# EAGLE design gbg_base_reva (EAGLE 9.1.3)
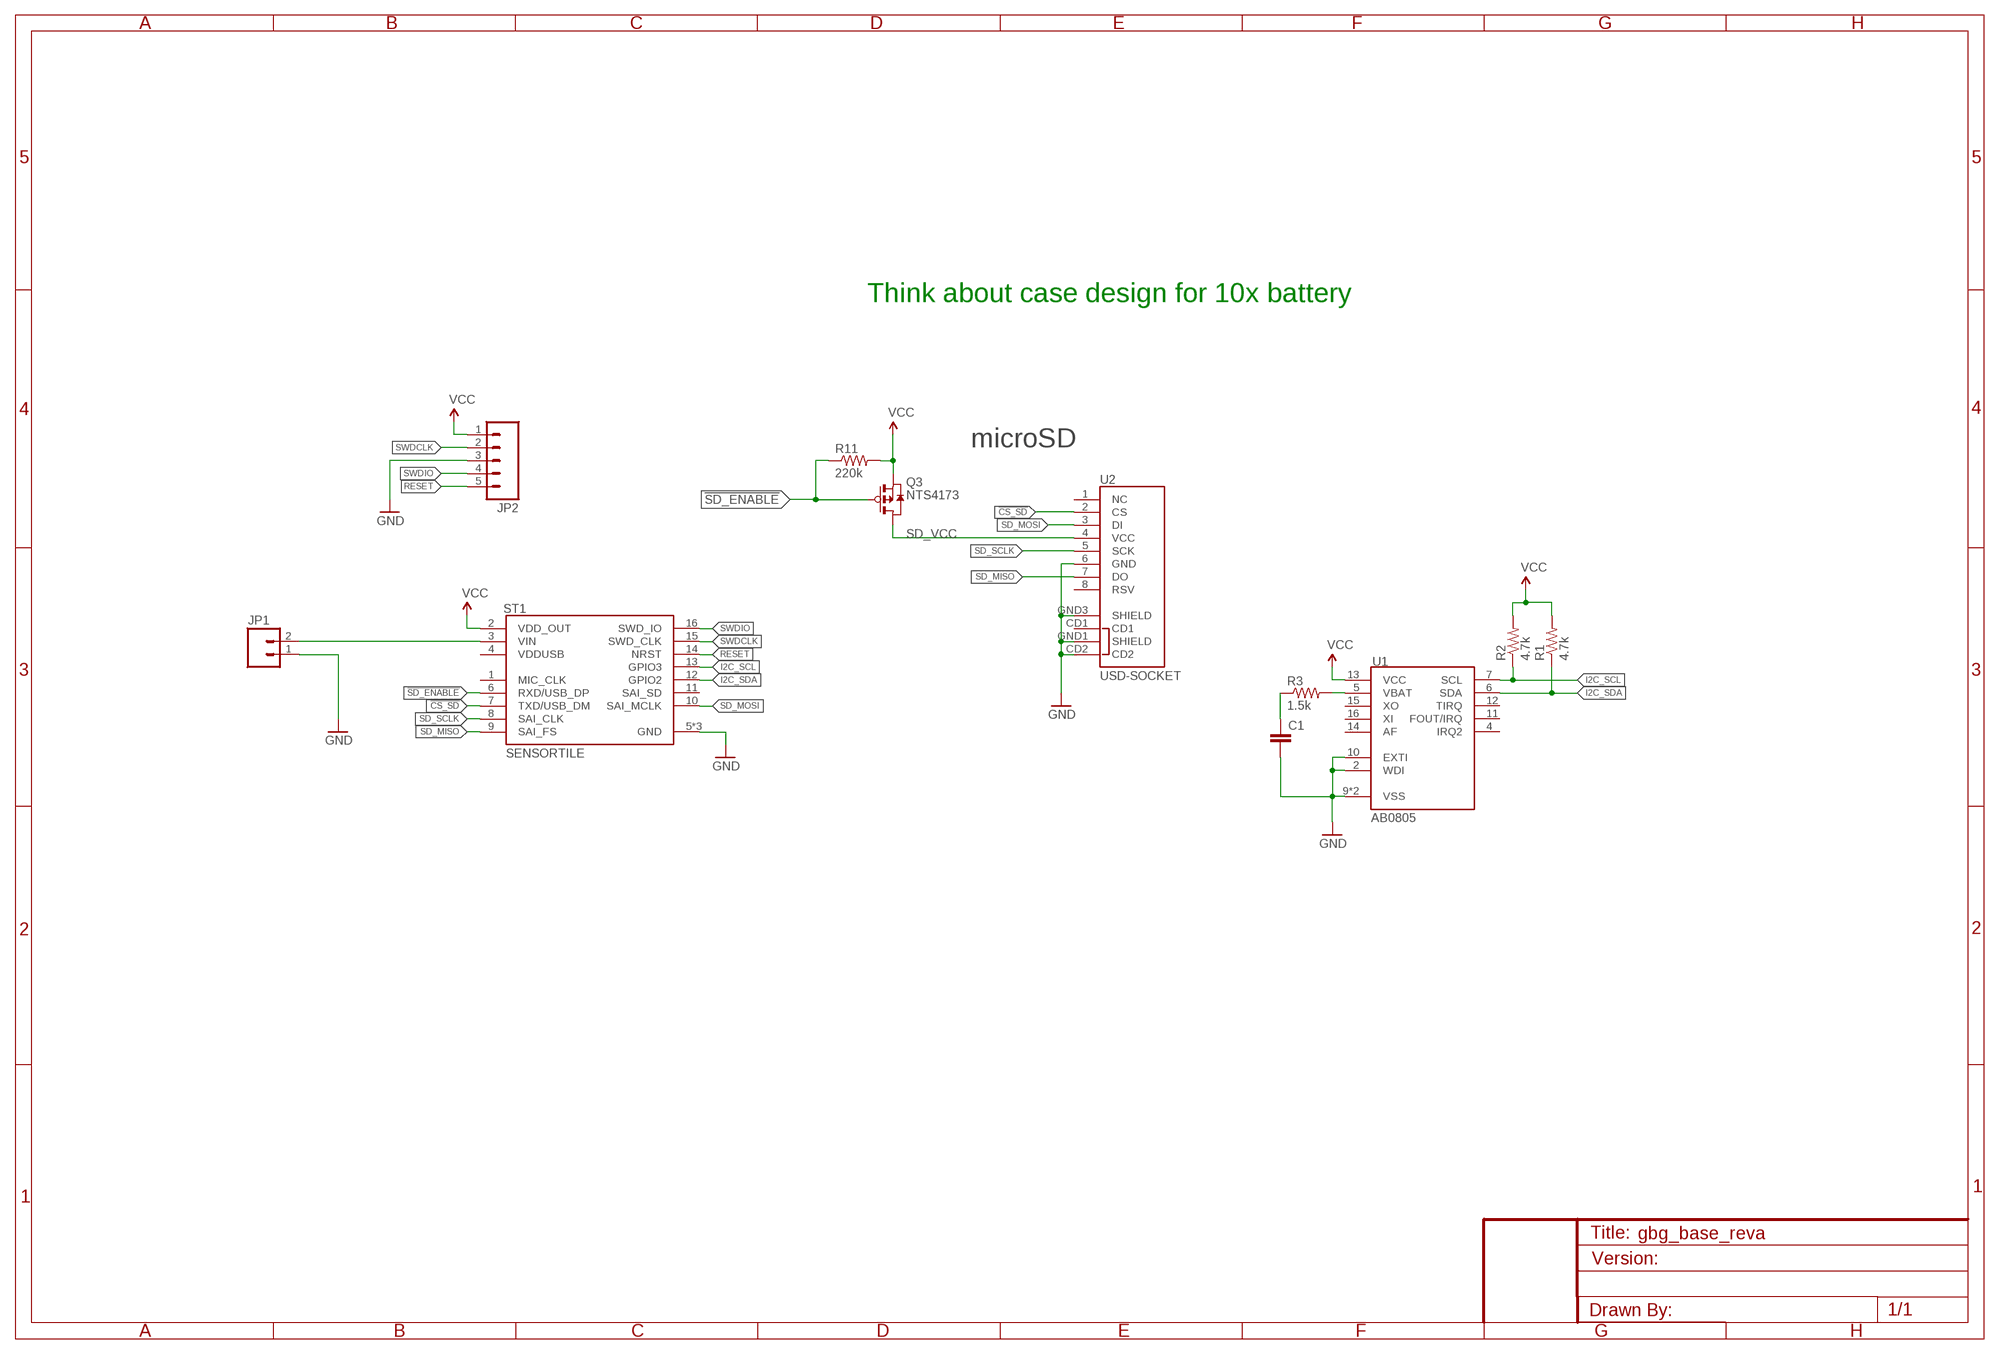
[diagram p0: schematic, sheet 1]

## Parts
C1  CAP1210  [1210]
JP1  M02PTH  [1X02]
JP2  M05LOCK  [1X05_LOCK]
Q3  NTS4173  [SC-70-3]
R1  4.7k  RESISTOR0603  [0603-RES]
R2  4.7k  RESISTOR0603  [0603-RES]
R3  1.5k  RESISTOR0603  [0603-RES]
R11  220k  R-EU0603  [0603]
ST1  SENSORTILE  [SENSORTILE]
U1  AB0805  [QFN16]
U2  USD-SOCKET  [MICROSD_1:1]

## Nets
!CS_SD: ST1.7(TXD/USB_DM) U2.2(CS)
!SD_ENABLE: Q3.P1(G) R11.1 ST1.6(RXD/USB_DP)
GND: C1.2 JP1.1 JP2.3 ST1.5(GND) ST1.17(GND) ST1.18(GND) U1.2(WDI) U1.9(VSS) U1.10(EXTI) U1.TH(VSS) U2.6(GND) U2.CD2 U2.GND1(SHIELD) U2.GND3(SHIELD)
I2C_SCL: R2.1 ST1.13(GPIO3) U1.7(SCL)
I2C_SDA: R1.1 ST1.12(GPIO2) U1.6(SDA)
N$1: C1.1 R3.1
N$5: R3.2 U1.5(VBAT)
RESET: JP2.5 ST1.14(NRST)
SD_MISO: ST1.9(SAI_FS) U2.7(DO)
SD_MOSI: ST1.10(SAI_MCLK) U2.3(DI)
SD_SCLK: ST1.8(SAI_CLK) U2.5(SCK)
SD_VCC: Q3.P3(D) U2.4(VCC)
SWDCLK: JP2.2 ST1.15(SWD_CLK)
SWDIO: JP2.4 ST1.16(SWD_IO)
VBAT: JP1.2 ST1.3(VIN)
VCC: JP2.1 Q3.P2(S) R1.2 R2.2 R11.2 ST1.2(VDD_OUT) U1.13(VCC)
Unconnected: ST1.1(MIC_CLK) ST1.4(VDDUSB) ST1.11(SAI_SD) U1.4(IRQ2) U1.11(FOUT/IRQ) U1.12(TIRQ) U1.14(AF) U1.15(XO) U1.16(XI) U2.1(NC) U2.8(RSV) U2.CD1

## Notes on the sheet
- Think about case design for 10x battery
- microSD

## Library data of the parts
C1 = SparkFun-Passives:CAP: Capacitor Standard 0603 ceramic capacitor, and 0.1" leaded capacitor.; DIGIKEY: 728-1067-2-ND
JP1 = SparkFun-Connectors:M02: Standard 2-pin 0.1" header. Use with - straight break away headers ( PRT-00116) - right angle break away headers (PRT-00553) - swiss pins (PRT-00743) - machine pins (PRT-00117) - female headers (PRT-00115) Molex polarized connector foot print use with: PRT-08233 with associated crimp pins and housings. 2.54_SCREWTERM for use with PRT-10571. 3.5mm Screw Terminal footprints for PRT-08084 5mm Screw Terminal footprints for use with PRT-08432
JP2 = SparkFun-Connectors:M05: Header 5 Standard 5-pin 0.1" header. Use with straight break away headers (SKU : PRT-00116), right angle break away headers (PRT-00553), swiss pins (PRT-00743), machine pins (PRT-00117), and female headers (PRT-00115). Molex polarized connector foot print use with SKU : PRT-08230 with associated crimp pins and housings.
Q3 = nts4173p:NTS4173: NTS4173P: Power MOSFET −30 V, −1.3 A, Single P−Channel, SC−70 Features • −30 V BVds, Low RDS(on) in SC−70 Package • Low Threshold Voltage • Fast Switching Speed • This is a Halide−Free Device • This is a Pb−Free Device Applications • Load Switch • Low Current Inverter and DC−DC Converters • Power Switch for Printers, Communication Equipment; DIGIKEY: NTS4173PT1GOSCT-ND
R1-R3 = SparkFun-Resistors:RESISTOR: Resistor Basic schematic elements and footprints for 0603, 1206, and PTH resistors.
R11 = tiny_passives:R-EU; DIGIKEY: RHM12.0KCDCT-ND
ST1 = sensortile:SENSORTILE
U1 = AB08XX:AB0805: AB08X5 Real-Time Clock Family: I2C Version The ABRACON AB08X5 Real-Time Clock family provides a groundbreaking combination of ultra-low power coupled with a highly sophisticated feature set. With power requirements significantly lower than any other industry RTC (as low as 14 nA), these are the first semiconductors based on innovative SPOTTM (Subthreshold Power Optimized Technology) CMOS platform. The AB08X5 includes on-chip oscillators to provide minimum power consumption, full RTC functions including battery backup and programmable counters and alarms for timer and watchdog functions, and either an I2C or SPI serial interface for communication with a host controller.; MOUSER: 815-AB0805-T3
U2 = SparkFun-Connectors:USD-SOCKET: microSD Socket Push-push type uSD socket. Schematic element and footprint production proven. Spark Fun Electronics SKU : PRT-00127. tDoc lines correctly indicate media card edge positions when inserting (unlocked, locked, depressed). NOTE: CD1 and CD2 are connected internally; DIGIKEY: WM3290CT-ND; PROD_ID: CONN-07820

## Net classes
0 default: width 0.33 mm, drill 0.33 mm, clearance 0.152 mm

## Board
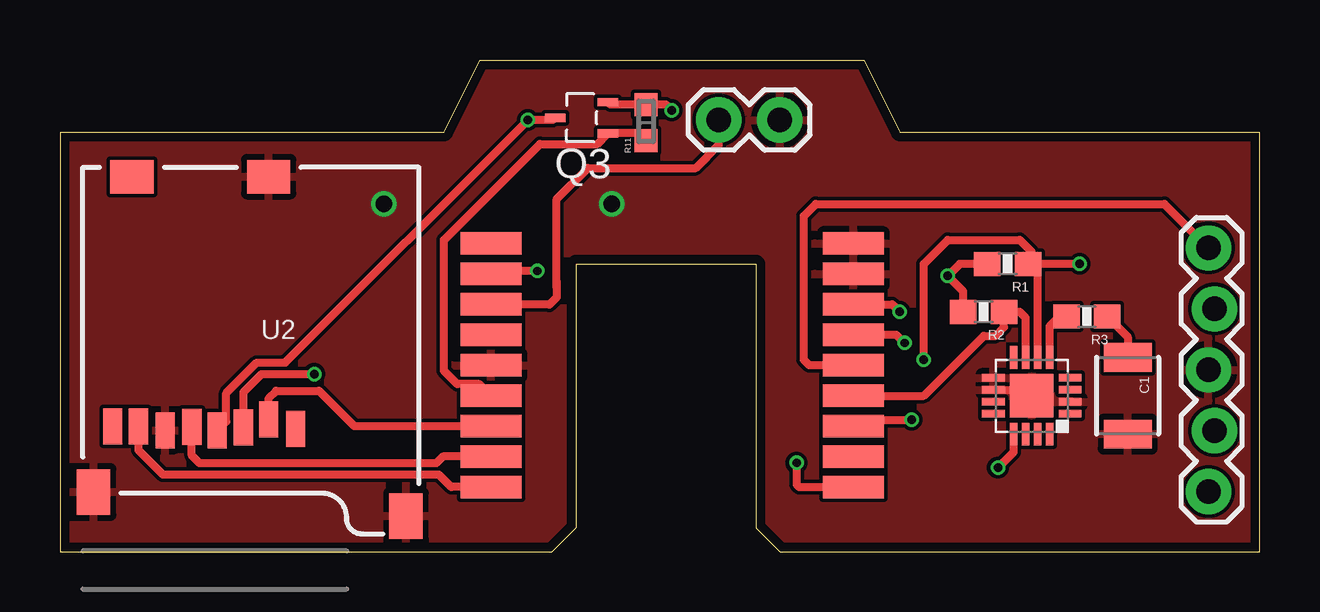
[diagram p1: board, top side]
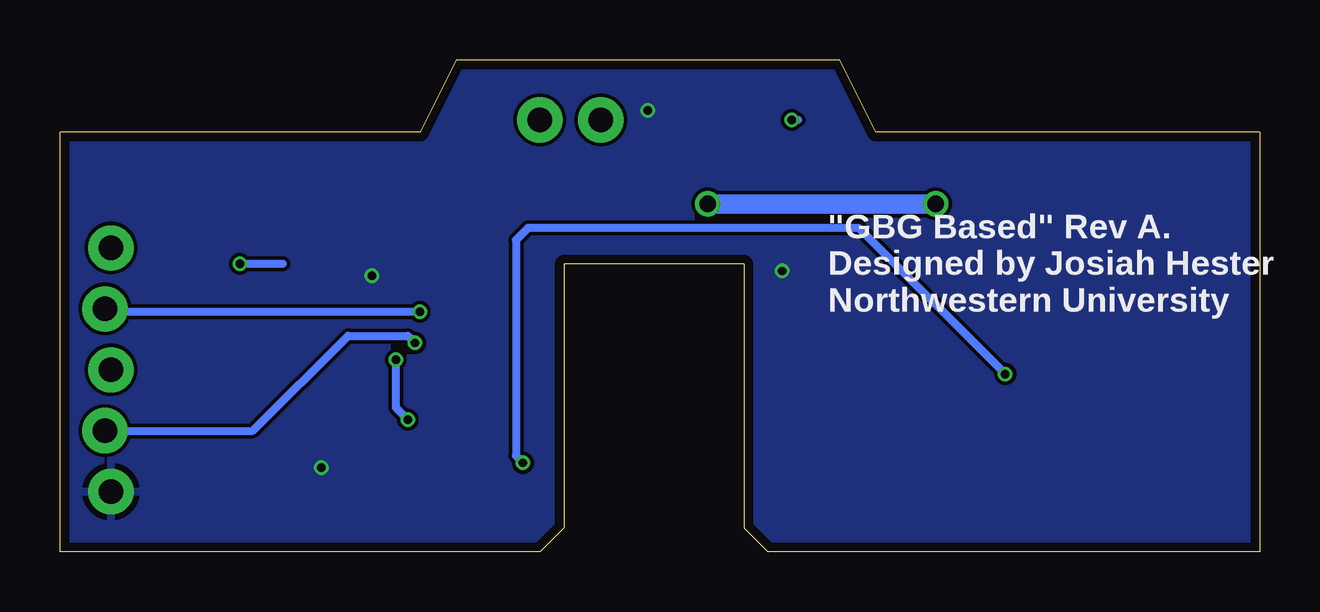
[diagram p2: board, bottom side, seen from below]

Size 50 x 20.5 mm. Coordinates in mm from the lower left corner, seen from the top.
Outline: 0,0 20.5,0 21.5,1 21.5,12 29,12 29,1 30,0 50,0 50,17.5 35,17.5 33.5,20.5 17.5,20.5 16,17.5 0,17.5 0,0
Copper layers (1*16): Top 0.035559375mm / dielectric 1.6mm / Bottom 0.035559375mm
Design rules "oshpark-2layer": minimum track width 6mil, minimum drill 10mil, track to track 6mil, track to pad 6mil, pad to pad 6mil, via to via 6mil, smd to smd 6mil, copper to edge 15mil, drill to drill 6mil, minimum pad ring 5mil, minimum via ring 5mil, stop-mask expansion 2.5mil, vias tented up to drill 0mil, thermal gap 10mil

### Footprints (pad centres in the part's own frame; a part is rotated, then mirrored left to right if it is on the bottom)
1210 = smd 1.2 x 2: 1 -1.6,0; 2 1.6,0
1X02 = drill 1.016 pad 1.88: 1 0,0; 2 2.54,0
1X05_LOCK = drill 1.016 pad 1.88: 1 0,0.127; 2 2.54,-0.127; 3 5.08,0.127; 4 7.62,-0.127; 5 10.16,0.127
SC-70-3 = smd 0.85 x 0.35: P1 -1.1,0.65; P2 -1.1,-0.65; P3 1.1,0
0603-RES = smd 1.1 x 1: 1 -0.85,0; 2 0.85,0
0603 = smd 0.95 x 0.95: 1 -0.75,0; 2 0.75,0
SENSORTILE = smd 2.54 x 0.94: 1 -2.54,6.35; 2 -2.54,5.08; 3 -2.54,3.81; 4 -2.54,2.54; 5 -2.54,1.27; 6 -2.54,0; 7 -2.54,-1.27; 8 -2.54,-2.54; 9 -2.54,-3.81; 10 12.573,-3.81; 11 12.573,-2.54; 12 12.573,-1.27; 13 12.573,0; 14 12.573,1.27; 15 12.573,2.54; 16 12.573,3.81; 17 12.573,5.08; 18 12.573,6.35
QFN16 = smd 0.95 x 0.3: 1 -1.6,0.75; 2 -1.6,0.25; 3 -1.6,-0.25; 4 -1.6,-0.75; 9 1.6,-0.75; 10 1.6,-0.25; 11 1.6,0.25; 12 1.6,0.75 | smd 0.3 x 0.95: 5 -0.75,-1.6; 6 -0.25,-1.6; 7 0.25,-1.6; 8 0.75,-1.6; 13 0.75,1.6; 14 0.25,1.6; 15 -0.25,1.6; 16 -0.75,1.6 | smd 1.8 x 1.8: TH 0,0
MICROSD_1:1 = smd 0.8 x 1.5: 1 5.096,10.919; 2 6.218,10.519; 3 7.274,10.853; 4 8.367,10.982; 5 9.421,10.828; 6 10.539,10.973; 7 11.648,10.819; 8 12.721,10.819 | smd 1.8 x 1.4: CD1 11.92,0.4; CD2 6.22,0.4 | smd 1.4 x 1.9: GND1 0.497,14.55; GND3 13.52,13.55

### Placement (x,y rotation side)
C1  44.5,6.5 270 top
JP1  30,18 180 top
JP2  48,2.5 90 top
Q3  21.74,18.09 180 top
R1  39.5,12 180 top
R2  38.5,10 180 top
R3  42.8,9.8 180 top
R11  24.43,17.89 90 top
ST1  20.5,6.5 0 top
U1  40.5,6.5 180 top
U2  14.92,16.03 180 top

### Tracks (layer width: path | path; a pad name or v marks a point on that pad's centre or on a via)
!CS_SD
  Top 0.33: ST1.7 12.27,5.23 10.8,6.7 9,6.7 8.7,6.4 U2.2
!SD_ENABLE
  Top 0.33: R11.1 24.13,17.44 Q3.P1 22.4,17 20,17 16,13 16,7.54 16.56,6.98 17.48,6.98 ST1.6
GND  (via drill 0.7)
  Top 0.33: U1.10 40.25,6.75 U1.TH
  Bottom 0.813: v23,14.5 v13.5,14.5
  pour Top: -7.5,-7.5 61.66,-7.5 61.66,26.56 -7.5,26.56
I2C_SCL
  Top 0.33: U1.7 40.25,9.75 40,10 R2.1 39.35,9.35 39,9 38.5,9 36,6.5 ST1.13
I2C_SDA  (via drill 0.35)
  Top 0.33: U1.6 40.75,11.6 R1.1 | 33.34,5.5 33.5,5.5 | 33.5,5.5 v35.5,5.5 | v42.5,12 R1.1 | v36,8 36,12 37,13 40,13 40.5,12.5 40.5,12.15 R1.1 | ST1.12 33.23,5.23 33.5,5.5
  Bottom 0.33: 40.7,12 v42.5,12 | v35.5,5.5 36,6 v36,8
N$1
  Top 0.33: 44.5,8.52 C1.1 44.5,8.95 R3.1
N$5
  Top 0.33: R3.2 41.6,9.75 41.25,9.4 U1.5
RESET
  Top 0.33: ST1.14 31.23,7.77 31,8 31,14 31.5,14.5 46.03,14.5 JP2.5
SD_MISO
  Top 0.33: ST1.9 16.31,2.69 15.8,3.2 4.3,3.2 3.27,4.23 U2.7
SD_MOSI  (via drill 0.35)
  Top 0.33: U2.3 7.65,6.65 8.4,7.4 v10.6,7.4 | v30.7,3.7 30.7,2.8 30.81,2.69 ST1.10
  Bottom 0.33: v10.6,7.4 16.7,13.5 30.5,13.5 31,13 31,4 v30.7,3.7
SD_SCLK
  Top 0.33: 17.92,4 ST1.8 15.96,3.96 15.68,3.68 5.82,3.68 5.5,4 U2.5
SD_VCC  (via drill 0.35)
  Top 0.33: Q3.P3 20.55,18 v19.5,18 v19.5,17.99 9.39,7.88 8.2,7.88 6.93,6.61 6.93,5.42 U2.4
  Bottom 0.33: 19.22,18 v19.5,18
SWDCLK  (via drill 0.35)
  Top 0.33: v35.2,8.7 34.86,9.04 ST1.15
  Bottom 0.33: JP2.2 41.96,5.04 38,9 35.5,9 v35.2,8.7
SWDIO  (via drill 0.35)
  Top 0.33: ST1.16 34.69,10.31 v35,10
  Bottom 0.33: v35,10 48.01,10 JP2.4
VBAT
  Top 0.33: ST1.3 20.39,10.31 20.4,10.3 20.7,10.6 20.7,11 | 20.7,11.24 20.7,11 | 20.7,11 20.7,14.7 22,16 26.5,16 27.46,16.96 JP1.2
VCC  (via drill 0.35)
  Top 0.33: R1.2 37.5,12 v37,11.5 37.65,10.85 R2.2 | U1.13 39.75,4.15 v39.1,3.5 | v19.9,11.7 18.08,11.7 ST1.2 | v25.5,18.4 25.26,18.64 R11.2 22.94,18.64 Q3.P2
  pour Bottom: -7.5,26.56 61.43,26.56 61.43,-7.5 -7.5,-7.5

### Text on the board
bPlace: "GBG Based" Rev A. / Designed by Josiah Hester / Northwestern University